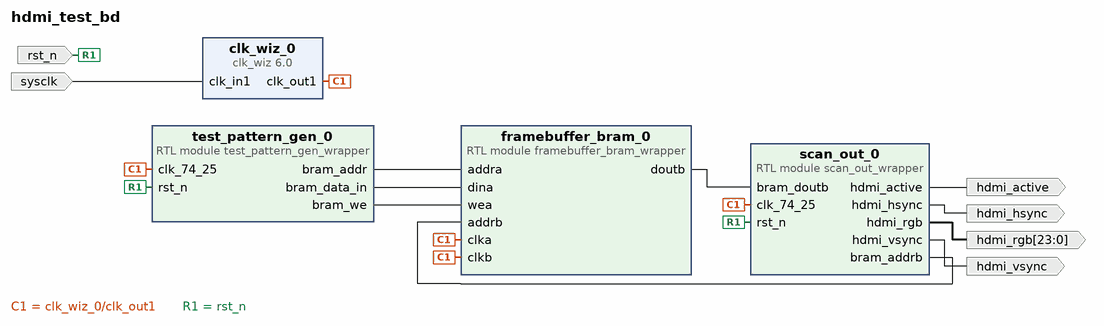
[diagram p0: block diagram of the top level]
# Vivado block design hdmi_test_bd, xc7z020clg400-1, Vivado 2025.2
create_bd_design hdmi_test_bd

create_bd_port -dir I -type rst rst_n
set_property -dict {CONFIG.POLARITY ACTIVE_LOW} [get_bd_ports rst_n]
create_bd_port -dir I -type clk sysclk
set_property -dict {CONFIG.FREQ_HZ 125000000} [get_bd_ports sysclk]
create_bd_port -dir O hdmi_hsync
create_bd_port -dir O hdmi_vsync
create_bd_port -dir O hdmi_active
create_bd_port -dir O -from 23 -to 0 hdmi_rgb

create_bd_cell -type ip -vlnv xilinx.com:ip:clk_wiz:6.0 clk_wiz_0
set_property -dict [list \
  CONFIG.CLKOUT1_REQUESTED_OUT_FREQ 74.25 \
  CONFIG.CLKOUT2_REQUESTED_OUT_FREQ 371.25 \
  CONFIG.CLKOUT2_USED true \
  CONFIG.PRIM_IN_FREQ 125.000 \
] [get_bd_cells clk_wiz_0]
create_bd_cell -type module -reference test_pattern_gen_wrapper test_pattern_gen_0
create_bd_cell -type module -reference framebuffer_bram_wrapper framebuffer_bram_0
create_bd_cell -type module -reference scan_out_wrapper scan_out_0

# ---- connections ----

connect_bd_net [get_bd_pins clk_wiz_0/clk_out1] \
  [get_bd_pins test_pattern_gen_0/clk_74_25] [get_bd_pins framebuffer_bram_0/clka] [get_bd_pins framebuffer_bram_0/clkb] \
  [get_bd_pins scan_out_0/clk_74_25]
connect_bd_net [get_bd_pins framebuffer_bram_0/doutb] [get_bd_pins scan_out_0/bram_doutb]
connect_bd_net [get_bd_ports rst_n] [get_bd_pins test_pattern_gen_0/rst_n] [get_bd_pins scan_out_0/rst_n]
connect_bd_net [get_bd_pins scan_out_0/bram_addrb] [get_bd_pins framebuffer_bram_0/addrb]
connect_bd_net [get_bd_pins scan_out_0/hdmi_active] [get_bd_ports hdmi_active]
connect_bd_net [get_bd_pins scan_out_0/hdmi_hsync] [get_bd_ports hdmi_hsync]
connect_bd_net [get_bd_pins scan_out_0/hdmi_rgb] [get_bd_ports hdmi_rgb]
connect_bd_net [get_bd_pins scan_out_0/hdmi_vsync] [get_bd_ports hdmi_vsync]
connect_bd_net [get_bd_ports sysclk] [get_bd_pins clk_wiz_0/clk_in1]
connect_bd_net [get_bd_pins test_pattern_gen_0/bram_addr] [get_bd_pins framebuffer_bram_0/addra]
connect_bd_net [get_bd_pins test_pattern_gen_0/bram_data_in] [get_bd_pins framebuffer_bram_0/dina]
connect_bd_net [get_bd_pins test_pattern_gen_0/bram_we] [get_bd_pins framebuffer_bram_0/wea]

validate_bd_design
save_bd_design
